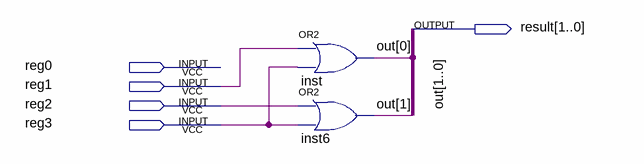
[diagram p0: schematic sheet]
// Quartus schematic encoder.bdf as structural Verilog: 2 symbols, 5 pins
module encoder (
  input  reg0,
  input  reg1,
  input  reg2,
  input  reg3,
  output [1:0] result
);

  or inst (result[0], reg1, reg3);
  or inst6 (result[1], reg2, reg3);

  // Other names for the same wires on the sheet: out[1:0] = result
endmodule
